# EAGLE schematic MSP-EXP430F5529_2_2 (EAGLE 6.5.0)

## Sheet 1 of 8
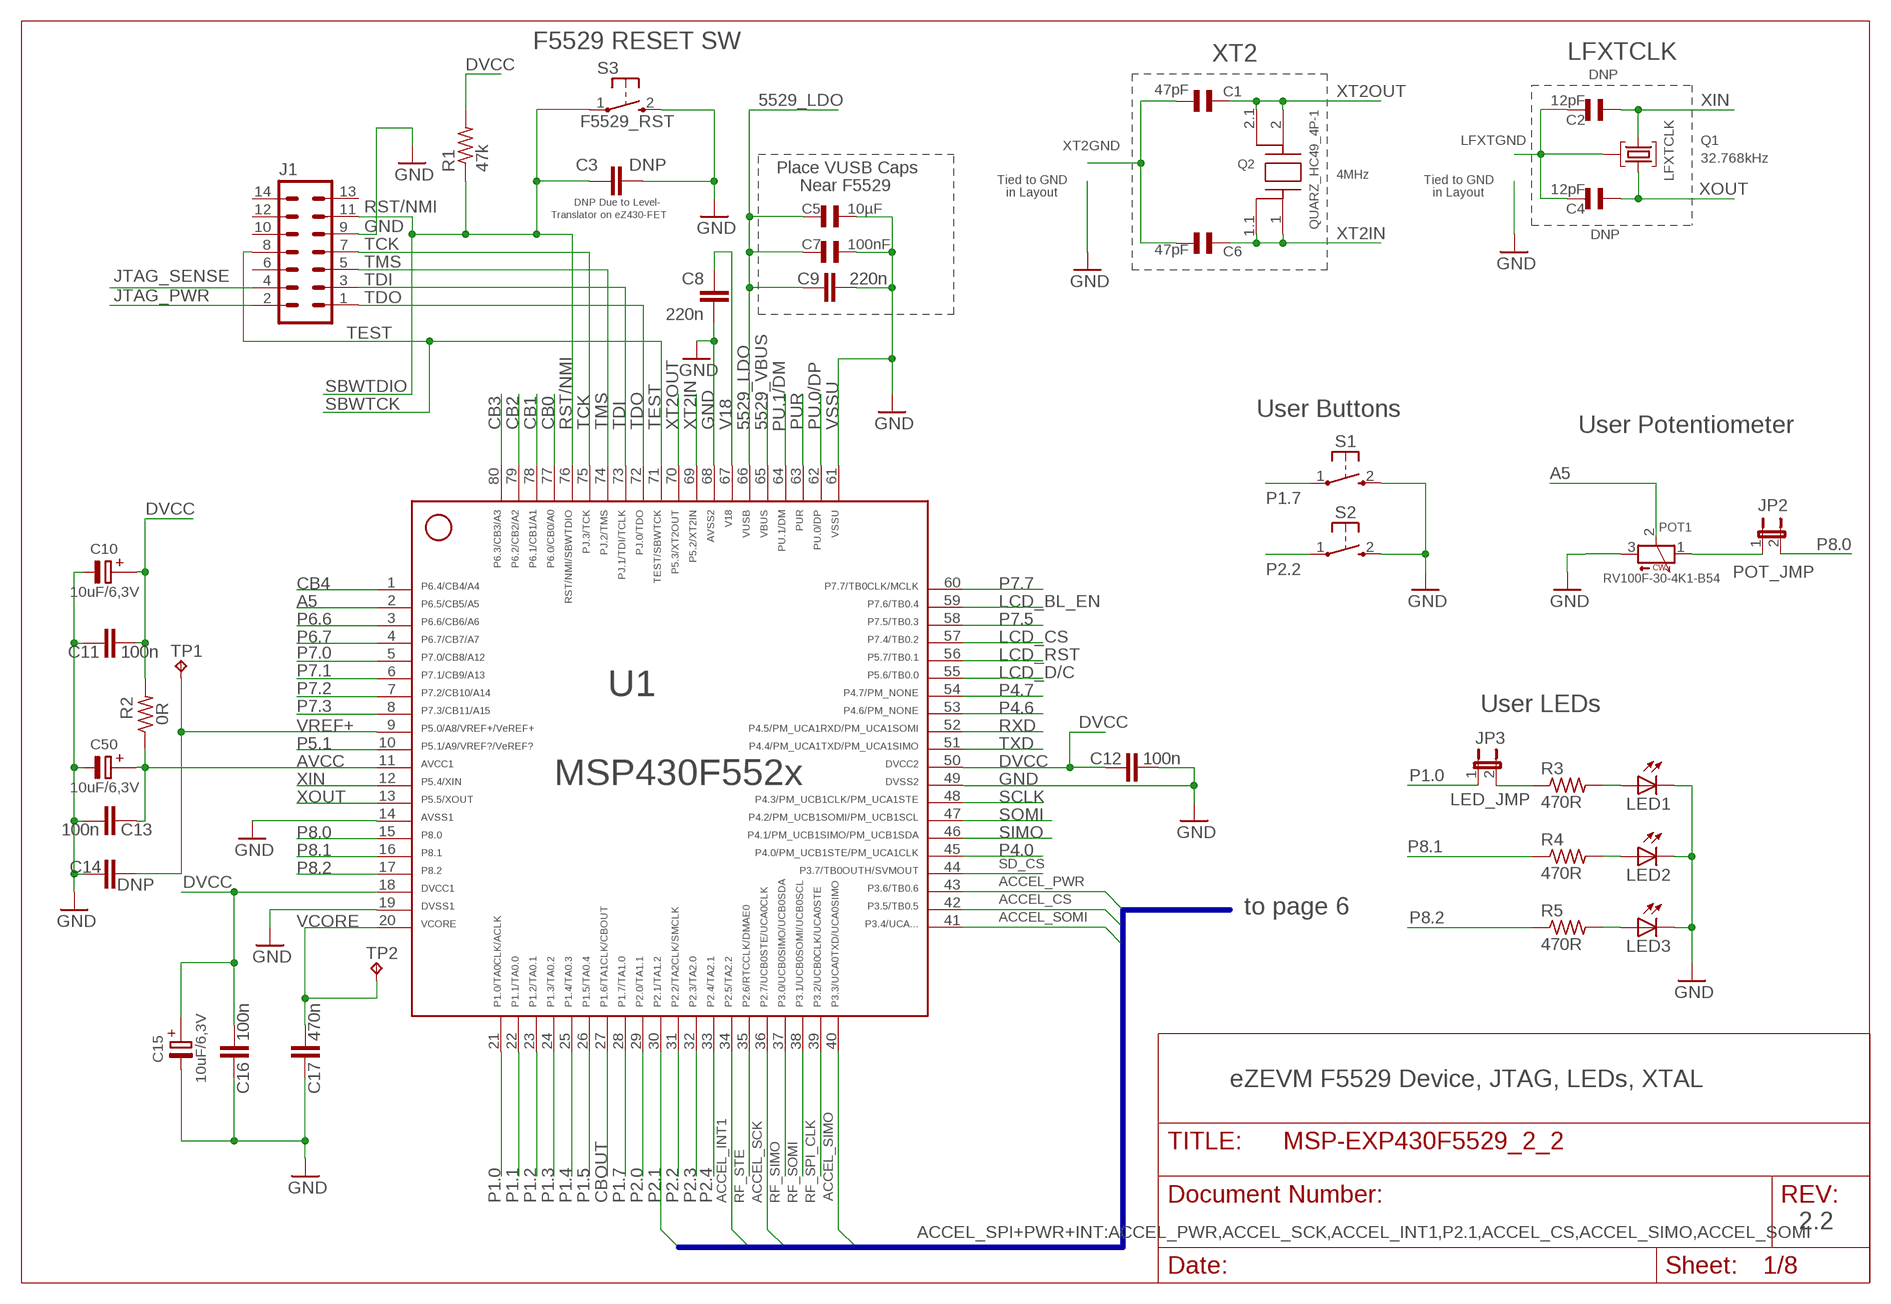
[diagram p0: schematic, sheet 1]

### Parts
C1  47pF  CSMD0805  [CSMD0805]
C2  12pF  CSMD0805  [CSMD0805]
C3  DNP  C-EUC0603  [C0603]
C4  12pF  CSMD0805  [CSMD0805]
C5  10µF  CSMD0805  [CSMD0805]
C6  47pF  CSMD0805  [CSMD0805]
C7  100nF  CSMD0805  [CSMD0805]
C8  220n  C-EUC0603  [C0603]
C9  220n  C-EUC0603  [C0603]
C10  10uF/6,3V  ELKO_1210  [1210ELKO]
C11  100n  C-EUC0603  [C0603]
C12  100n  C-EUC0805  [C0805]
C13  100n  C-EUC0805  [C0805]
C14  DNP  C-EUC0603  [C0603]
C15  10uF/6,3V  ELKO_1210  [1210ELKO]
C16  100n  C-EUC0805  [C0805]
C17  470n  C-EUC0805  [C0805]
C50  10uF/6,3V  ELKO_1210  [1210ELKO]
J1  ML14  [ML14]
JP2  POT_JMP  JP1E\SMALL_PIN  [JP1S]
JP3  LED_JMP  JP1E\SMALL_PIN  [JP1S]
LED1  LEDCHIPLED_0603  [CHIPLED_0603]
LED2  LEDCHIPLED_0603  [CHIPLED_0603]
LED3  LEDCHIPLED_0603  [CHIPLED_0603]
POT1  RV100F-30-4K1-B54  [TW-700171]
Q1  32.768kHz  F20XX_PIR_DEMO_&_EVAL_CM200T  [F20XX_PIR_DEMO_&_EVAL_CMJ206T]
Q2  QUARZ_HC49_4P-1  [QUARZ_HC49_4P]
R1  47k  R-US_R0603  [R0603]
R2  0R  R-US_R0603  [R0603]
R3  470R  R-US_R0603  [R0603]
R4  470R  R-US_R0603  [R0603]
R5  470R  R-US_R0603  [R0603]
S1  PB  [PBTH]
S2  PB  [PBTH]
S3  F5529_RST  PB  [PBTH]
TP1  TP  [TP]
TP2  TP  [TP]
U1  MSP430F5529IPNR  F552X---PN80  [PN80]

### Nets
5529_LDO [Power]: C5.1 C7.1 C9.1 U1.66 ; also sheet 3,4
5529_VBUS [Power]: U1.65 ; also sheet 3,4
A5: POT1.2(TAP) U1.2
ACCEL_CS: U1.42 ; also sheet 7
ACCEL_INT1: U1.34 ; also sheet 7
ACCEL_PWR: U1.43 ; also sheet 7
ACCEL_SCK: U1.36 ; also sheet 7
ACCEL_SIMO: U1.40 ; also sheet 7
ACCEL_SOMI: U1.41 ; also sheet 7
AVCC: C13.1 C50.+ R2.1 U1.11
CB0: U1.77 ; also sheet 2
CB1: U1.78 ; also sheet 2
CB2: U1.79 ; also sheet 2
CB3: U1.80 ; also sheet 2
CB4: U1.1 ; also sheet 2
CBOUT: U1.27 ; also sheet 2
DVCC [Power]: C10.+ C11.2 C12.1 C15.+ C16.2 R1.2 R2.2 U1.18 U1.50 ; also sheet 3,5
GND [Ground]: C3.1 C5.2 C7.2 C8.2 C9.2 C10.- C11.1 C12.2 C13.2 C14.1 C15.- C16.1 C17.1 C50.- J1.9 LED1.C LED2.C LED3.C POT1.3(CW) S1.2(S) S2.2(S) S3.2(S) U1.14 U1.19 U1.49 U1.61 U1.68 ; also sheet 2,3,4,5,6,7
JTAG_PWR [Power]: J1.2 ; also sheet 3
JTAG_SENSE: J1.4 ; also sheet 3
LCD_BL_EN: U1.59 ; also sheet 3
LCD_CS: U1.57 ; also sheet 3
LCD_D/C: U1.55 ; also sheet 3
LCD_RST: U1.56 ; also sheet 3
LFXTGND: C2.2 C4.2 Q1.P3(GND)
N$21: LED3.A R5.2
N$32: LED1.A R3.2
N$35: LED2.A R4.2
N$36: JP3.2 R3.1
N$43: JP2.1 POT1.1(CCW)
P1.0: JP3.1 U1.21 ; also sheet 4
P1.1: U1.22 ; also sheet 2
P1.2: U1.23 ; also sheet 2
P1.3: U1.24 ; also sheet 2
P1.4: U1.25 ; also sheet 2
P1.5: U1.26 ; also sheet 2
P1.7: S1.1(P) U1.28
P2.0: U1.29 ; also sheet 4
P2.1: U1.30 ; also sheet 4,7
P2.2: S2.1(P) U1.31
P2.3: U1.32 ; also sheet 4
P2.4: U1.33 ; also sheet 4
P4.0: U1.45 ; also sheet 2,4
P4.6: U1.53 ; also sheet 2,4
P4.7: U1.54 ; also sheet 2,4
P5.1: U1.10 ; also sheet 2
P6.6: U1.3 ; also sheet 2,4
P6.7: U1.4 ; also sheet 2
P7.0: U1.5 ; also sheet 2
P7.1: U1.6 ; also sheet 2
P7.2: U1.7 ; also sheet 2
P7.3: U1.8 ; also sheet 2
P7.5: U1.58 ; also sheet 4
P7.7: U1.60 ; also sheet 2
P8.0: JP2.2 U1.15 ; also sheet 2
P8.1: R4.1 U1.16 ; also sheet 2
P8.2: R5.1 U1.17 ; also sheet 2
PU.0/DP: U1.62 ; also sheet 4
PU.1/DM: U1.64 ; also sheet 4
PUR: U1.63 ; also sheet 4
RF_SIMO: U1.37 ; also sheet 4
RF_SOMI: U1.38 ; also sheet 4
RF_SPI_CLK: U1.39 ; also sheet 4
RF_STE: U1.35 ; also sheet 4
RST/NMI: C3.2 J1.11 R1.1 S3.1(P) U1.76 ; also sheet 5
RXD: U1.52 ; also sheet 2,4,5
SCLK: U1.48 ; also sheet 2,3
SD_CS: U1.44 ; also sheet 2
SIMO: U1.46 ; also sheet 2,3
SOMI: U1.47 ; also sheet 2
TCK: J1.7 U1.75
TDI: J1.3 U1.73
TDO: J1.1 U1.72
TEST: J1.8 U1.71 ; also sheet 5
TMS: J1.5 U1.74
TXD: U1.51 ; also sheet 2,4,5
V18: C8.1 U1.67
VCORE: C17.2 TP2.1(TP) U1.20
VREF+: C14.2 TP1.1(TP) U1.9
XIN: C2.1 Q1.P2 U1.12
XOUT: C4.1 Q1.P1 U1.13
XT2GND [Ground]: C1.2 C6.2
XT2IN: C6.1 Q2.1 Q2.1.1 U1.69
XT2OUT: C1.1 Q2.2 Q2.2.1 U1.70
Unconnected: J1.6 J1.10 J1.12 J1.13 J1.14

### Buses
ACCEL_SPI+PWR+INT:ACCEL_PWR,ACCEL_SCK,ACCEL_INT1,P2.1,ACCEL_CS,ACCEL_SIMO,ACCEL_SOMI

### Notes on the sheet
- F5529 RESET SW
- XT2 | LFXTCLK
- DNP
- Place VUSB Caps | 4MHz
- Tied to GND | Tied to GND | LFXTCLK
- Near F5529
- in Layout | in Layout
- DNP Due to Level-
- Translator on eZ430-FET
- DNP
- SBWTDIO
- SBWTCK
- User Buttons
- VSSU | User Potentiometer
- User LEDs
- to page 6
- eZEVM F5529 Device, JTAG, LEDs, XTAL
- 2.2

## Sheet 2 of 8
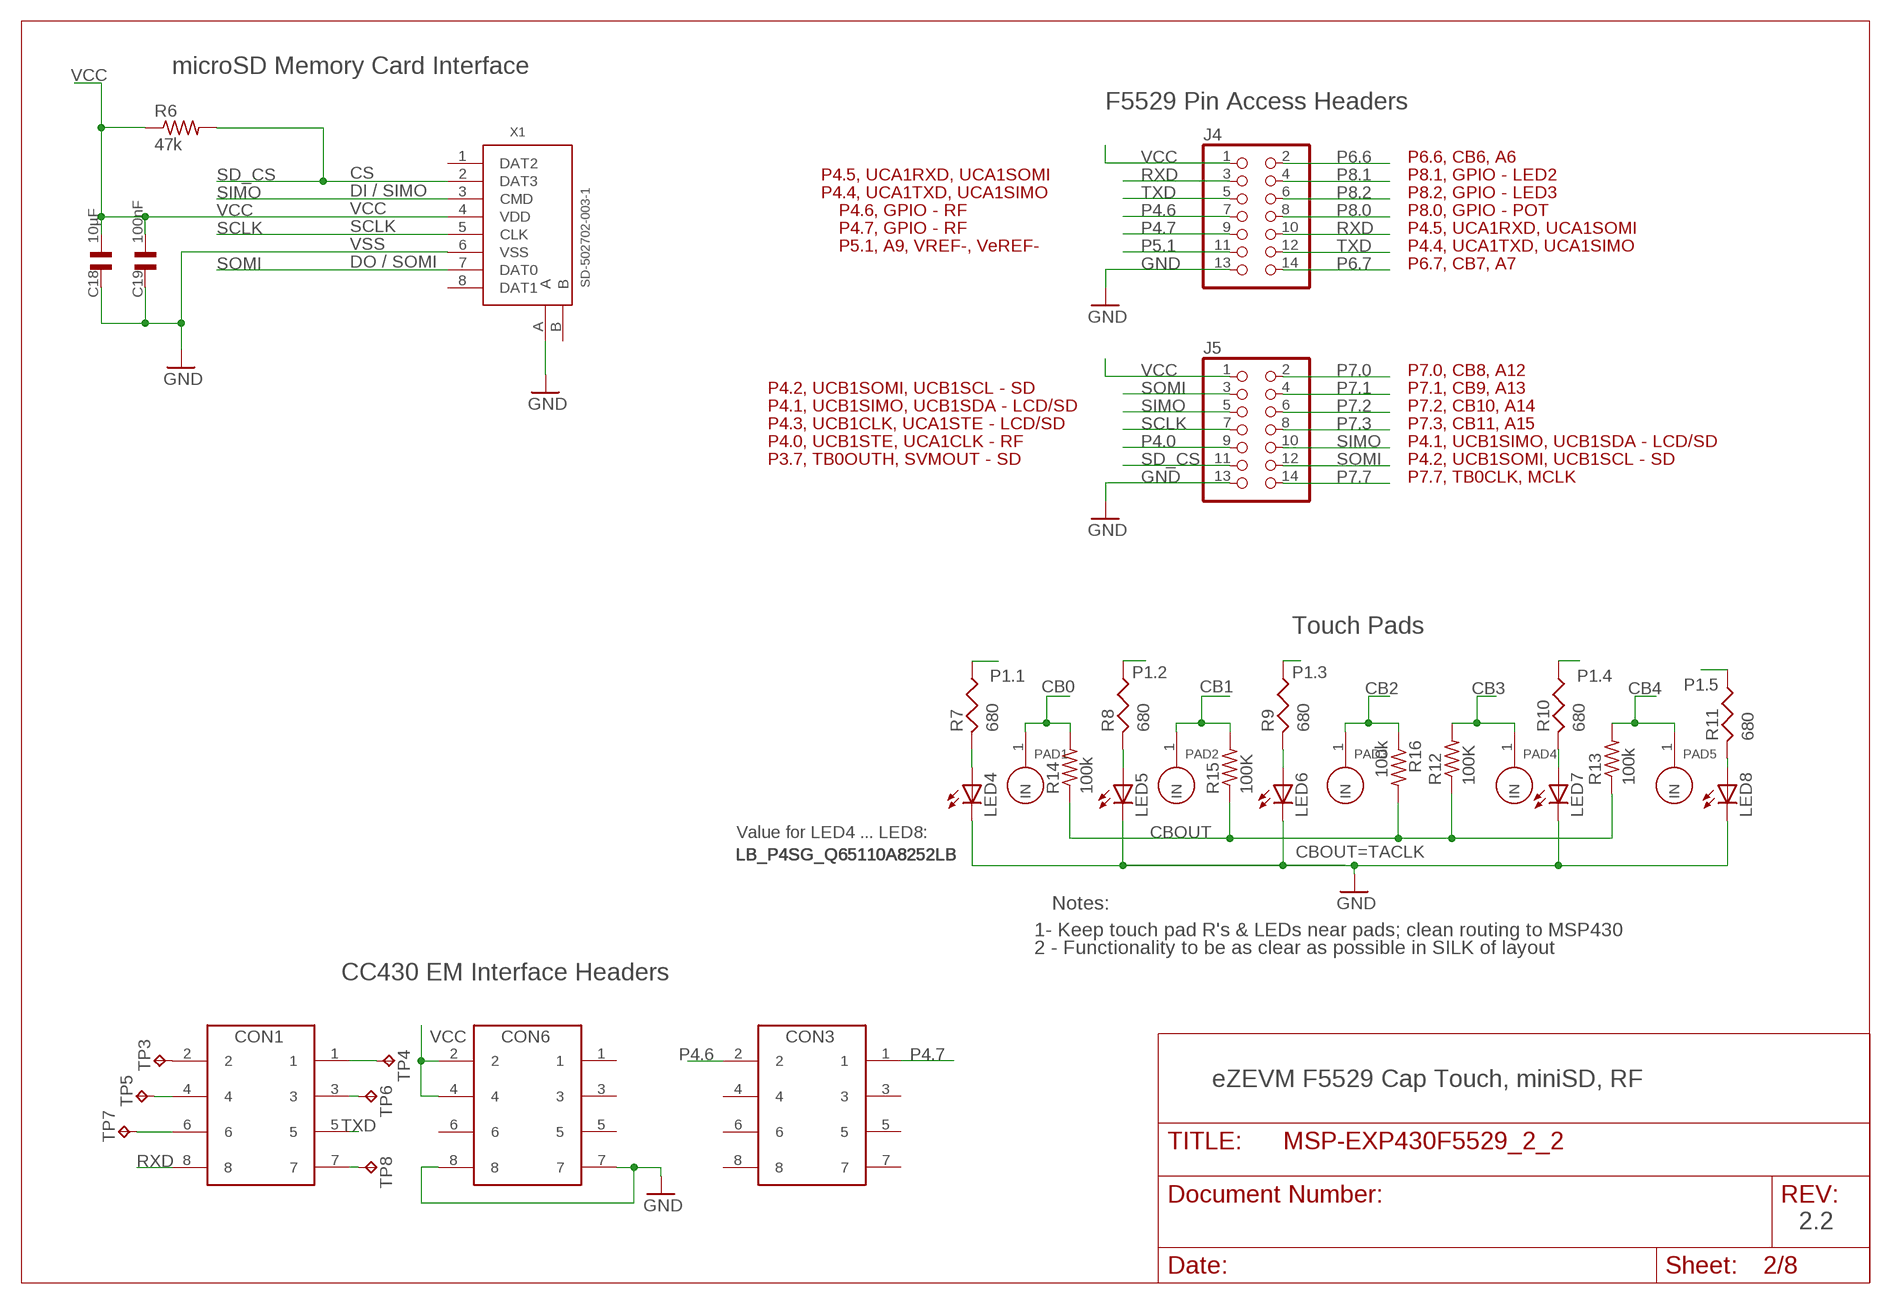
[diagram p1: schematic, sheet 2]

### Parts
C18  10µF  CSMD0805  [CSMD0805]
C19  100nF  CSMD0805  [CSMD0805]
CON1  8PIN_SM_MA_HEADER  [8PIN_SM_MA_HEADER]
CON2  8PIN_SM_MA_HEADER  [8PIN_SM_MA_HEADER]
CON3  8PIN_SM_MA_HEADER  [8PIN_SM_MA_HEADER]
J4  PINHD-2X7  [2X07]
J5  PINHD-2X7  [2X07]
LED4  LB_P4SG_Q65110A8252LB  [LB_P4SG_Q65110A8252]
LED5  LB_P4SG_Q65110A8252LB  [LB_P4SG_Q65110A8252]
LED6  LB_P4SG_Q65110A8252LB  [LB_P4SG_Q65110A8252]
LED7  LB_P4SG_Q65110A8252LB  [LB_P4SG_Q65110A8252]
LED8  LB_P4SG_Q65110A8252LB  [LB_P4SG_Q65110A8252]
PAD1  TPAD_TOPLB_P4SG  [PAD_10X10_LB_P4SG]
PAD2  TPAD_TOPLB_P4SG  [PAD_10X10_LB_P4SG]
PAD3  TPAD_TOPLB_P4SG  [PAD_10X10_LB_P4SG]
PAD4  TPAD_TOPLB_P4SG  [PAD_10X10_LB_P4SG]
PAD5  TPAD_TOPLB_P4SG  [PAD_10X10_LB_P4SG]
R6  47k  R-US_R0603  [R0603]
R7  680  RES0805  [R0805]
R8  680  RES0805  [R0805]
R9  680  RES0805  [R0805]
R10  680  RES0805  [R0805]
R11  680  RES0805  [R0805]
R12  100K  R-US_R0603  [R0603]
R13  100k  R-US_R0603  [R0603]
R14  100k  R-US_R0603  [R0603]
R15  100K  R-US_R0603  [R0603]
R16  100k  R-US_R0603  [R0603]
TP3  TP  [TP]
TP4  TP  [TP]
TP5  TP  [TP]
TP6  TP  [TP]
TP7  TP  [TP]
TP8  TP  [TP]
X1  SD-502702-003-1  [SD-502702-003]

### Nets
CB0: PAD1.1(IN) R14.2 ; also sheet 1
CB1: PAD2.1(IN) R15.2 ; also sheet 1
CB2: PAD3.1(IN) R16.1 ; also sheet 1
CB3: PAD4.1(IN) R12.2 ; also sheet 1
CB4: PAD5.1(IN) R13.2 ; also sheet 1
CBOUT: R12.1 R13.1 R14.1 R15.1 R16.2 ; also sheet 1
GND [Ground]: C18.1 C19.1 CON2.7 CON2.8 J4.13 J5.13 LED4.C LED5.C LED6.C LED7.C LED8.C X1.6(VSS) X1.A ; also sheet 1,3,4,5,6,7
N$7: LED7.A R10.2
N$8: LED5.A R8.2
N$10: LED6.A R9.2
N$11: LED4.A R7.2
N$12: CON1.6 TP7.1(TP)
N$13: LED8.A R11.2
N$20: CON1.4 TP5.1(TP)
N$27: CON1.2 TP3.1(TP)
N$28: CON1.1 TP4.1(TP)
N$29: CON1.3 TP6.1(TP)
N$38: CON1.7 TP8.1(TP)
P1.1: R7.1 ; also sheet 1
P1.2: R8.1 ; also sheet 1
P1.3: R9.1 ; also sheet 1
P1.4: R10.1 ; also sheet 1
P1.5: R11.1 ; also sheet 1
P4.0: J5.9 ; also sheet 1,4
P4.6: CON3.2 J4.7 ; also sheet 1,4
P4.7: CON3.1 J4.9 ; also sheet 1,4
P5.1: J4.11 ; also sheet 1
P6.6: J4.2 ; also sheet 1,4
P6.7: J4.14 ; also sheet 1
P7.0: J5.2 ; also sheet 1
P7.1: J5.4 ; also sheet 1
P7.2: J5.6 ; also sheet 1
P7.3: J5.8 ; also sheet 1
P7.7: J5.14 ; also sheet 1
P8.0: J4.8 ; also sheet 1
P8.1: J4.4 ; also sheet 1
P8.2: J4.6 ; also sheet 1
RXD: CON1.8 J4.3 J4.10 ; also sheet 1,4,5
SCLK: J5.7 X1.5(CLK) ; also sheet 1,3
SD_CS: J5.11 R6.2 X1.2(DAT3) ; also sheet 1
SIMO: J5.5 J5.10 X1.3(CMD) ; also sheet 1,3
SOMI: J5.3 J5.12 X1.7(DAT0) ; also sheet 1
TXD: CON1.5 J4.5 J4.12 ; also sheet 1,4,5
VCC [Power]: C18.2 C19.2 CON2.2 CON2.4 J4.1 J5.1 R6.1 X1.4(VDD) ; also sheet 3,4
Unconnected: CON2.1 CON2.3 CON2.5 CON2.6 CON3.3 CON3.4 CON3.5 CON3.6 CON3.7 CON3.8 X1.1(DAT2) X1.8(DAT1) X1.B

### Notes on the sheet
- microSD Memory Card Interface
- F5529 Pin Access Headers
- P6.6, CB6, A6
- CS | P4.5, UCA1RXD, UCA1SOMI | P8.1, GPIO - LED2
- DI / SIMO | P4.4, UCA1TXD, UCA1SIMO | P8.2, GPIO - LED3
- VCC | P4.6, GPIO - RF | P8.0, GPIO - POT
- SCLK | P4.7, GPIO - RF | P4.5, UCA1RXD, UCA1SOMI
- VSS | P5.1, A9, VREF-, VeREF- | P4.4, UCA1TXD, UCA1SIMO
- DO / SOMI | P6.7, CB7, A7
- P7.0, CB8, A12
- P4.2, UCB1SOMI, UCB1SCL - SD | P7.1, CB9, A13
- P4.1, UCB1SIMO, UCB1SDA - LCD/SD | P7.2, CB10, A14
- P4.3, UCB1CLK, UCA1STE - LCD/SD | P7.3, CB11, A15
- P4.0, UCB1STE, UCA1CLK - RF | P4.1, UCB1SIMO, UCB1SDA - LCD/SD
- P3.7, TB0OUTH, SVMOUT - SD | P4.2, UCB1SOMI, UCB1SCL - SD
- P7.7, TB0CLK, MCLK
- Touch Pads
- Value for LED4 ... LED8:
- CBOUT=TACLK
- Notes:
- 1- Keep touch pad R's & LEDs near pads; clean routing to MSP430
- 2 - Functionality to be as clear as possible in SILK of layout
- CC430 EM Interface Headers
- CON1 | CON6 | CON3
- eZEVM F5529 Cap Touch, miniSD, RF
- 2.2

## Sheet 3 of 8
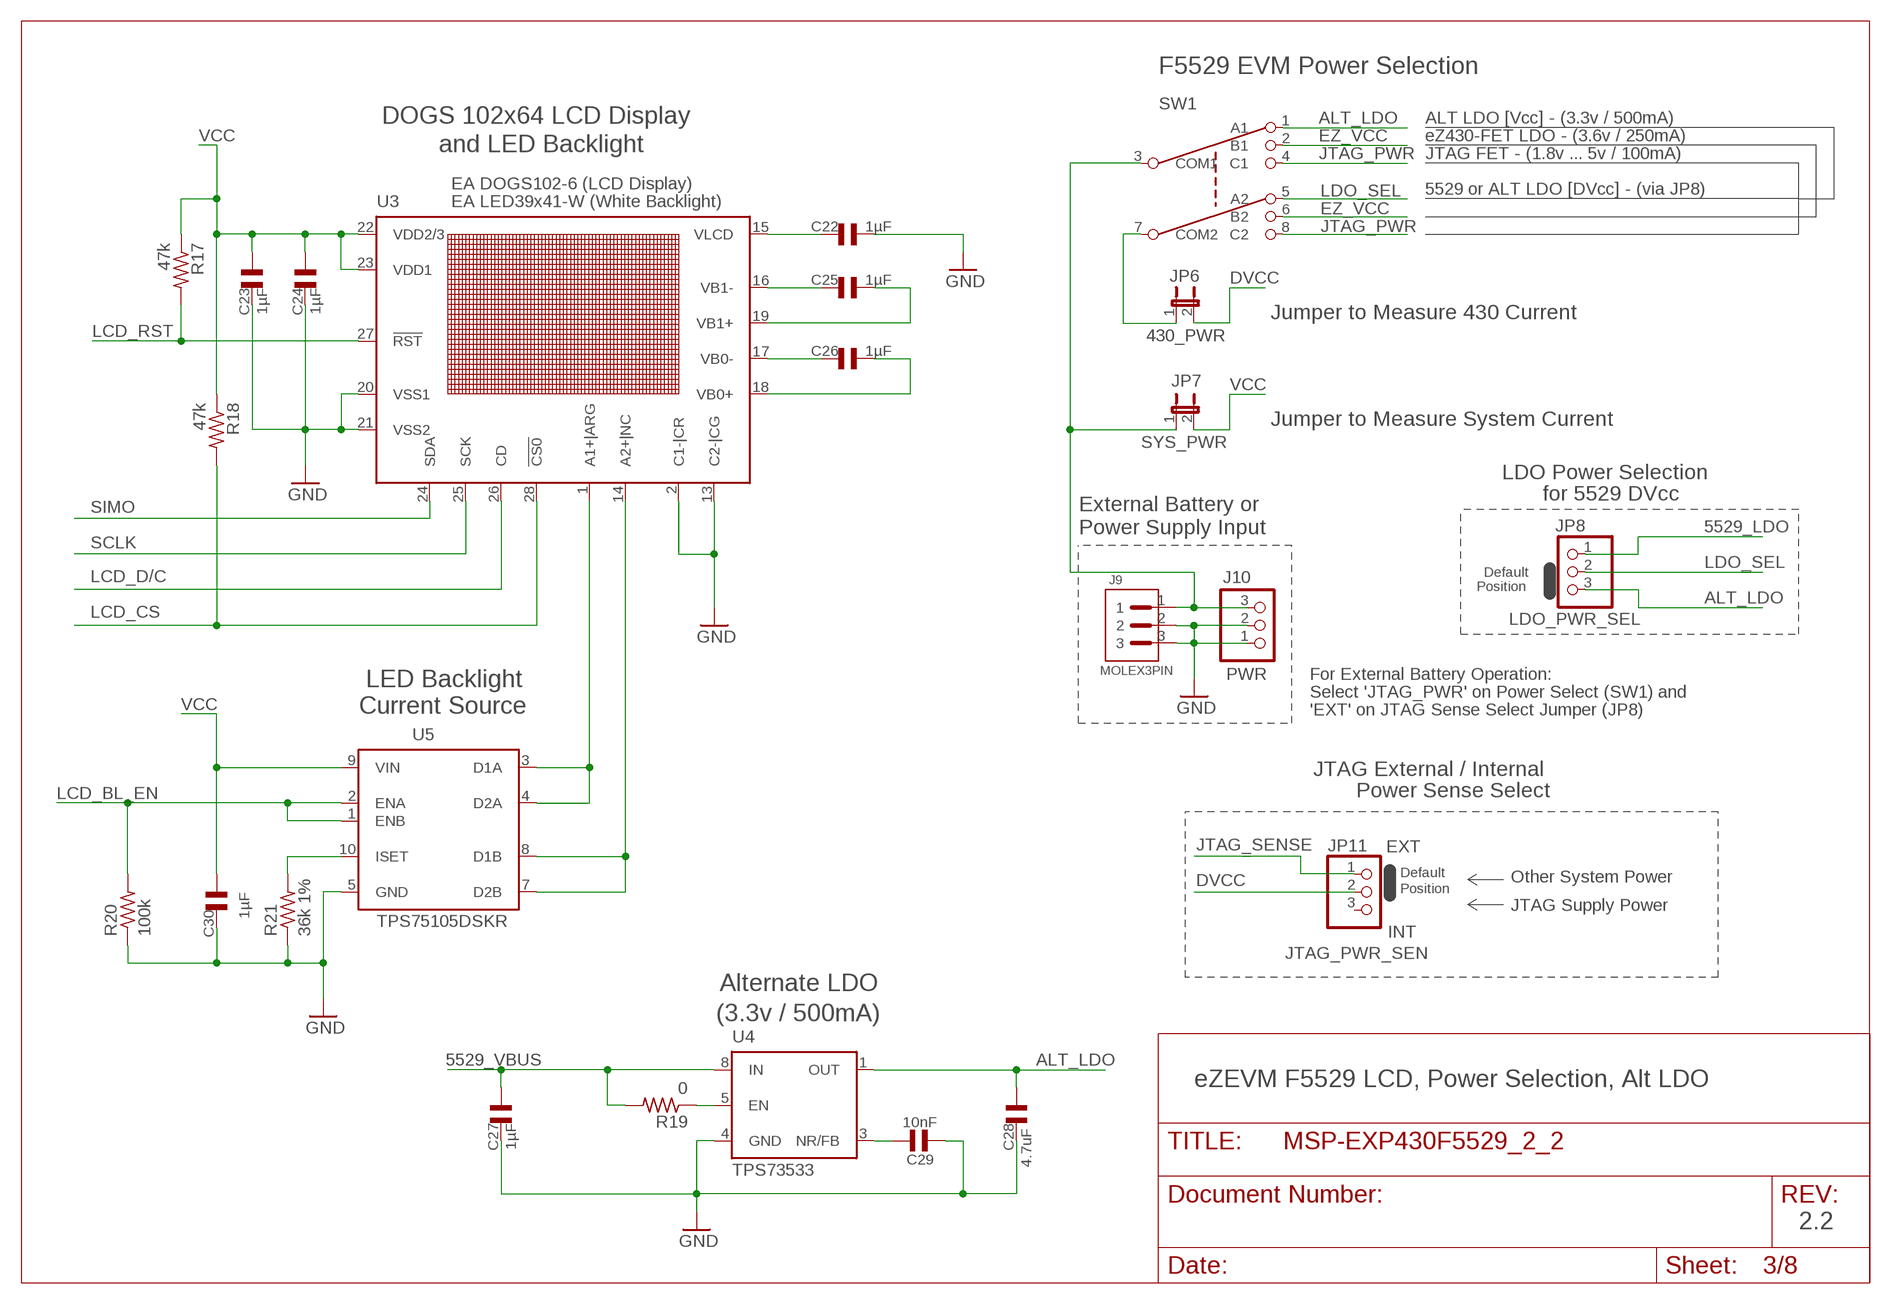
[diagram p2: schematic, sheet 3]

### Parts
C22  1µF  CSMD0805  [CSMD0805]
C23  1µF  CSMD0805  [CSMD0805]
C24  1µF  CSMD0805  [CSMD0805]
C25  1µF  CSMD0805  [CSMD0805]
C26  1µF  CSMD0805  [CSMD0805]
C27  1µF  CSMD0805  [CSMD0805]
C28  4.7uF  CSMD0805  [CSMD0805]
C29  10nF  CSMD0805  [CSMD0805]
C30  1µF  CSMD0805  [CSMD0805]
J9  MOLEX3PIN  [MOLEX-3P-HEADER]
J10  PWR  PINHD-1X3  [1X03]
JP6  430_PWR  JP1E  [JP1]
JP7  SYS_PWR  JP1E  [JP1]
JP8  LDO_PWR_SEL  PINHD-1X3/SMALL_PIN  [1X03S]
JP11  JTAG_PWR_SEN  PINHD-1X3/SMALL_PIN  [1X03S]
R17  47k  R-US_R0603  [R0603]
R18  47k  R-US_R0603  [R0603]
R19  0  R-US_R0603  [R0603]
R20  100k  R-US_R0603  [R0603]
R21  36k 1%  R-US_R0603  [R0603]
SW1  3PDT  [3PDT]
U3  EA DOGS102-6 (LCD Display)  EADOGS102-6  [EADOGS102-6]
U4  TPS73533  TPS735  [DRB_S-PVSON-N8]
U5  TPS75105DSKR  TPS7510X  [DSK_S-PDSO-N10]

### Nets
5529_LDO [Power]: JP8.1 ; also sheet 1,4
5529_VBUS [Power]: C27.2 R19.2 U4.8(IN) ; also sheet 1,4
ALT_LDO [Power]: C28.2 JP8.3 SW1.1(A1) U4.1(OUT)
D1A: U3.1(A1+|ARG) U5.3(D1A) U5.4(D2A)
D1B: U3.14(A2+|NC) U5.7(D2B) U5.8(D1B)
DVCC [Power]: JP6.2 JP11.2 ; also sheet 1,5
DVCC_SW [Power]: JP6.1 SW1.7(COM2)
EZ_VCC [Power]: SW1.2(B1) SW1.6(B2) ; also sheet 5,6
GND [Ground]: C22.2 C23.1 C24.1 C27.1 C28.1 C29.1 C30.1 J9.2 J9.3 J10.1 J10.2 R20.1 R21.1 U3.2(C1-|CR) U3.13(C2-|CG) U3.20(VSS1) U3.21(VSS2) U4.4(GND) U5.5(GND) ; also sheet 1,2,4,5,6,7
ISET: R21.2 U5.10(ISET)
JTAG_PWR [Power]: SW1.4(C1) SW1.8(C2) ; also sheet 1
JTAG_SENSE: JP11.1 ; also sheet 1
LCD_BL_EN: R20.2 U5.1(ENB) U5.2(ENA) ; also sheet 1
LCD_CS: R18.2 U3.28(!CS0) ; also sheet 1
LCD_D/C: U3.26(CD) ; also sheet 1
LCD_RST: R17.2 U3.27(!RST) ; also sheet 1
LDO_SEL [Power]: JP8.2 SW1.5(A2)
N$14: R19.1 U4.5(EN)
N$41: C25.1 U3.16(VB1-)
N$44: C25.2 U3.19(VB1+)
N$45: C26.1 U3.17(VB0-)
N$46: C26.2 U3.18(VB0+)
N$50: C29.2 U4.3(NR/FB)
SCLK: U3.25(SCK) ; also sheet 1,2
SIMO: U3.24(SDA) ; also sheet 1,2
VCC [Power]: C23.2 C24.2 C30.2 JP7.2 R17.1 R18.1 U3.22(VDD2/3) U3.23(VDD1) U5.9(VIN) ; also sheet 2,4
VCC_SW [Power]: J9.1 J10.3 JP7.1 SW1.3(COM1)
VLCD: C22.1 U3.15(VLCD)
Unconnected: JP11.3

### Notes on the sheet
- F5529 EVM Power Selection
- DOGS 102x64 LCD Display | ALT LDO [Vcc] - (3.3v / 500mA)
- eZ430-FET LDO - (3.6v / 250mA)
- and LED Backlight
- JTAG FET - (1.8v ... 5v / 100mA)
- 5529 or ALT LDO [DVcc] - (via JP8)
- EA LED39x41-W (White Backlight)
- Jumper to Measure 430 Current
- Jumper to Measure System Current
- LDO Power Selection
- for 5529 DVcc
- External Battery or
- Power Supply Input
- Default
- Position
- For External Battery Operation:
- LED Backlight
- Select 'JTAG_PWR' on Power Select (SW1) and
- Current Source | 'EXT' on JTAG Sense Select Jumper (JP8)
- JTAG External / Internal
- Power Sense Select
- EXT
- Default
- Other System Power
- Position
- JTAG Supply Power
- INT
- Alternate LDO
- (3.3v / 500mA)
- eZEVM F5529 LCD, Power Selection, Alt LDO
- 2.2

## Sheet 4 of 8
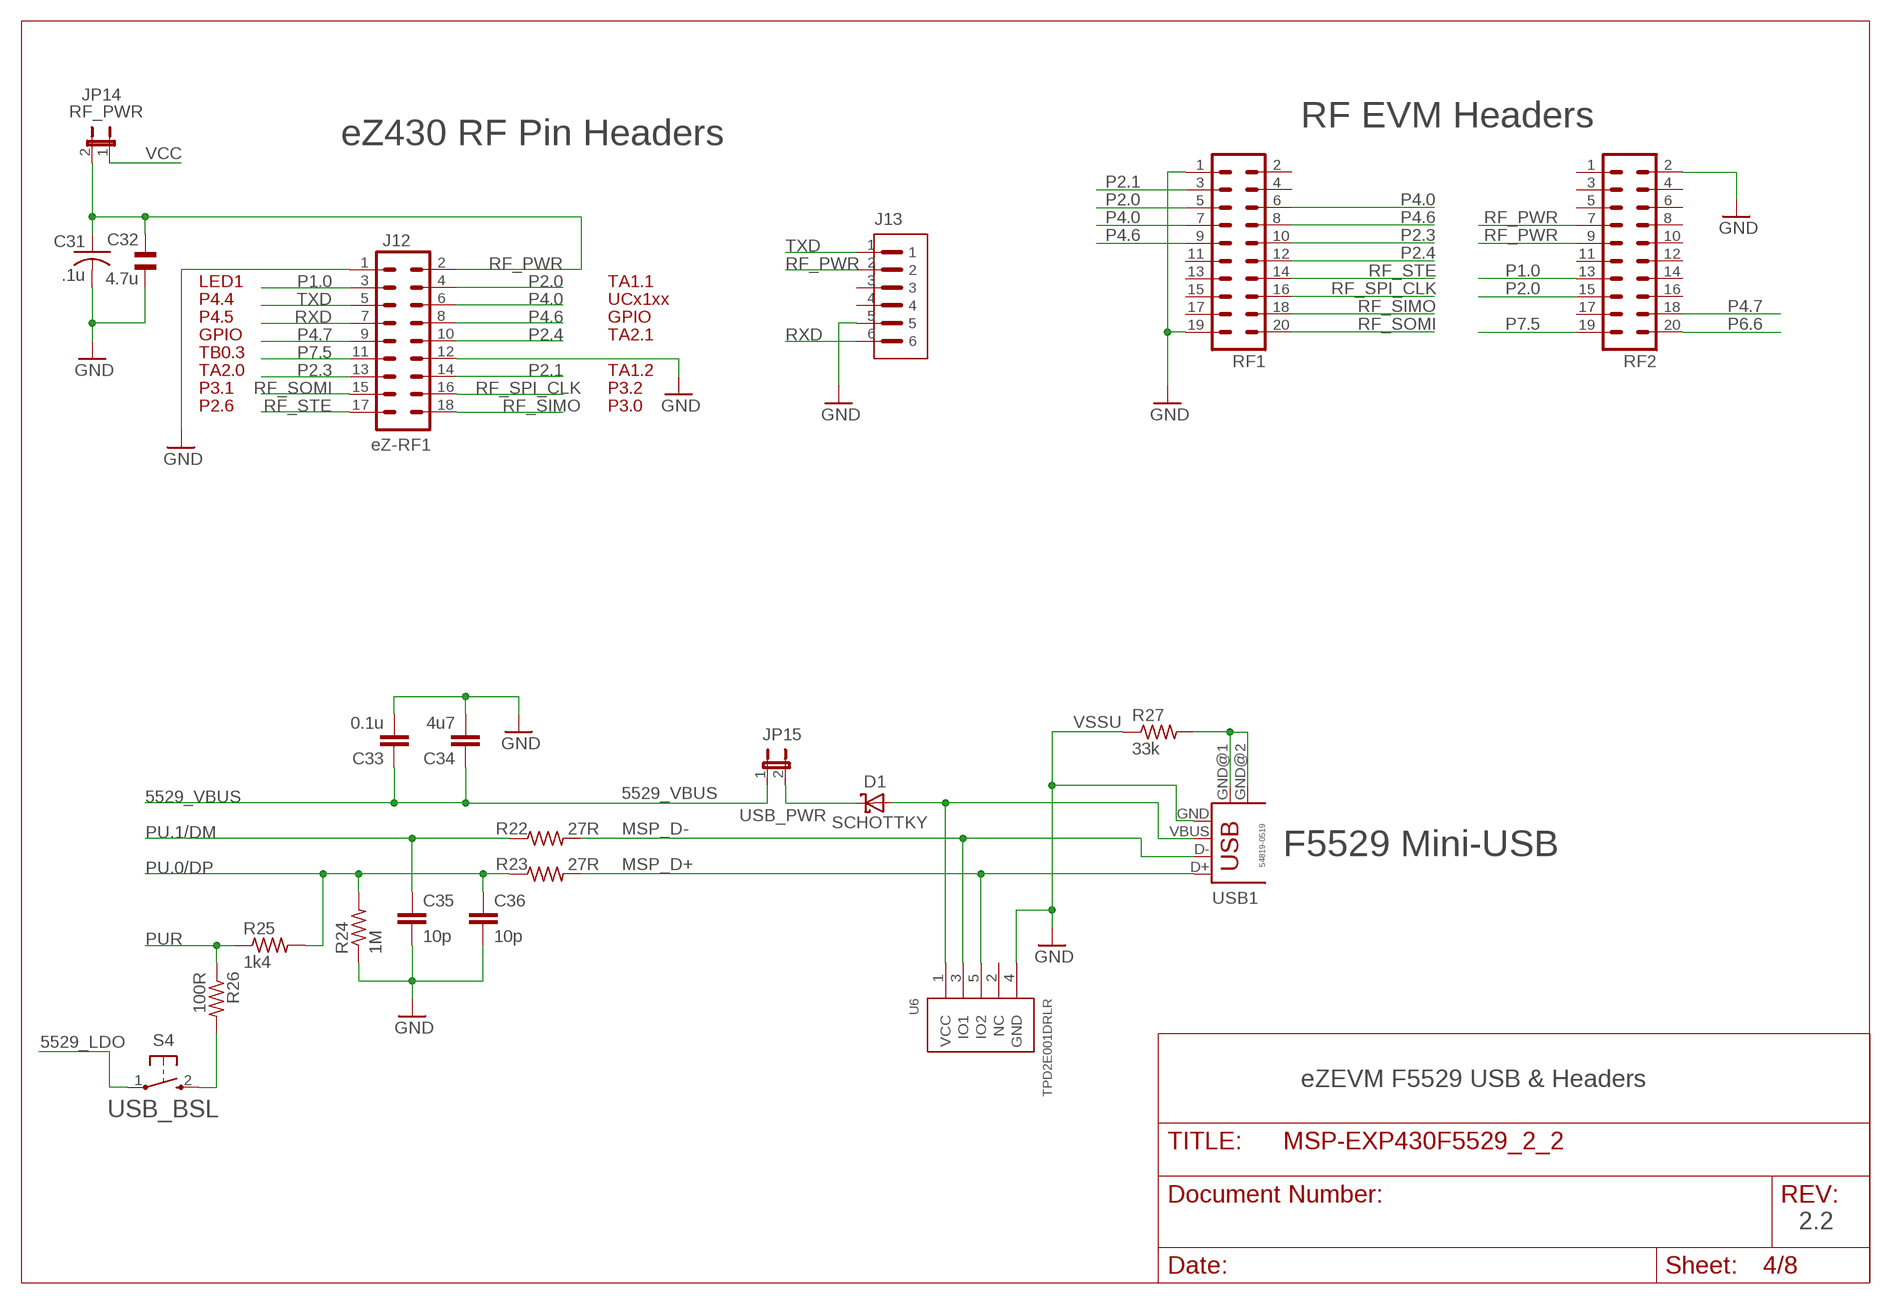
[diagram p3: schematic, sheet 4]

### Parts
C31  .1u  C-USC0603  [C0603]
C32  4.7u  CSMD0805  [CSMD0805]
C33  0.1u  C-EUC0603  [C0603]
C34  4u7  C-EUC0603  [C0603]
C35  10p  C-EUC0603  [C0603]
C36  10p  C-EUC0603  [C0603]
D1  SCHOTTKY  SCHOTTKY-MINI-MELF  [MINIMELF]
J12  eZ-RF1  _MSP430_RF_MA09-2  [_MSP430_RF_MA09-2]
J13  eZRF  SL127P6  [SL127L6]
JP14  RF_PWR  JP1E  [JP1]
JP15  USB_PWR  JP1E  [JP1]
R22  27R  R-US_R0603  [R0603]
R23  27R  R-US_R0603  [R0603]
R24  1M  R-US_R0603  [R0603]
R25  1k4  R-US_R0603  [R0603]
R26  100R  R-US_R0603  [R0603]
R27  33k  R-US_R0603  [R0603]
RF1  TFM-110-02-SM-D-A-K  [TFM-110-02-SM-D-A-K]
RF2  TFM-110-02-SM-D-A-K  [TFM-110-02-SM-D-A-K]
S4  USB_BSL  PB  [PBTH]
U6  TPD2E001DRLR  TPD2E001  [TPD2E001-DRL]
USB1  F5529 Mini-USB  USB-MB-H  [USB-MB-H]

### Nets
5529_LDO [Power]: S4.1(P) ; also sheet 1,3
5529_VBUS [Power]: C33.1 C34.1 JP15.1 ; also sheet 1,3
GND [Ground]: C31.2 C32.2 C33.2 C34.2 C35.2 C36.2 J12.1 J12.12 J13.5 R24.1 R27.1 RF1.1 RF1.19 RF2.2 U6.4(GND) USB1.GND ; also sheet 1,2,3,5,6,7
MSP_D+: R23.2 U6.5(IO2) USB1.D+
MSP_D-: R22.2 U6.3(IO1) USB1.D-
N$24: D1.C JP15.2
N$39: R27.2 USB1.GND@1(GND) USB1.GND@2(GND)
N$40: R26.2 S4.2(S)
N$42: D1.A U6.1(VCC) USB1.VBUS
P1.0: J12.3 RF2.13 ; also sheet 1
P2.0: J12.4 RF1.5 RF2.15 ; also sheet 1
P2.1: J12.14 RF1.3 ; also sheet 1,7
P2.3: J12.13 RF1.10 ; also sheet 1
P2.4: J12.10 RF1.12 ; also sheet 1
P4.0: J12.6 RF1.6 RF1.7 ; also sheet 1,2
P4.6: J12.8 RF1.8 RF1.9 ; also sheet 1,2
P4.7: J12.9 RF2.18 ; also sheet 1,2
P6.6: RF2.20 ; also sheet 1,2
P7.5: J12.11 RF2.19 ; also sheet 1
PU.0/DP: C36.1 R23.1 R24.2 R25.2 ; also sheet 1
PU.1/DM: C35.1 R22.1 ; also sheet 1
PUR: R25.1 R26.1 ; also sheet 1
RF_PWR: C31.1 C32.1 J12.2 J13.2 JP14.2 RF2.7 RF2.9
RF_SIMO: J12.18 RF1.18 ; also sheet 1
RF_SOMI: J12.15 RF1.20 ; also sheet 1
RF_SPI_CLK: J12.16 RF1.16 ; also sheet 1
RF_STE: J12.17 RF1.14 ; also sheet 1
RXD: J12.7 J13.6 ; also sheet 1,2,5
TXD: J12.5 J13.1 ; also sheet 1,2,5
VCC [Power]: JP14.1 ; also sheet 2,3
Unconnected: J13.3 J13.4 RF1.2 RF1.4 RF1.11 RF1.13 RF1.15 RF1.17 RF2.1 RF2.3 RF2.4 RF2.5 RF2.6 RF2.8 RF2.10 RF2.11 RF2.12 RF2.14 RF2.16 RF2.17 U6.2(NC)

### Notes on the sheet
- RF EVM Headers
- eZ430 RF Pin Headers
- LED1 | TA1.1
- P4.4 | UCx1xx
- P4.5 | GPIO
- GPIO | TA2.1
- TB0.3
- TA2.0 | TA1.2
- P3.1 | P3.2
- P2.6 | P3.0
- VSSU
- 54819-0519
- eZEVM F5529 USB & Headers
- 2.2

## Sheet 5 of 8
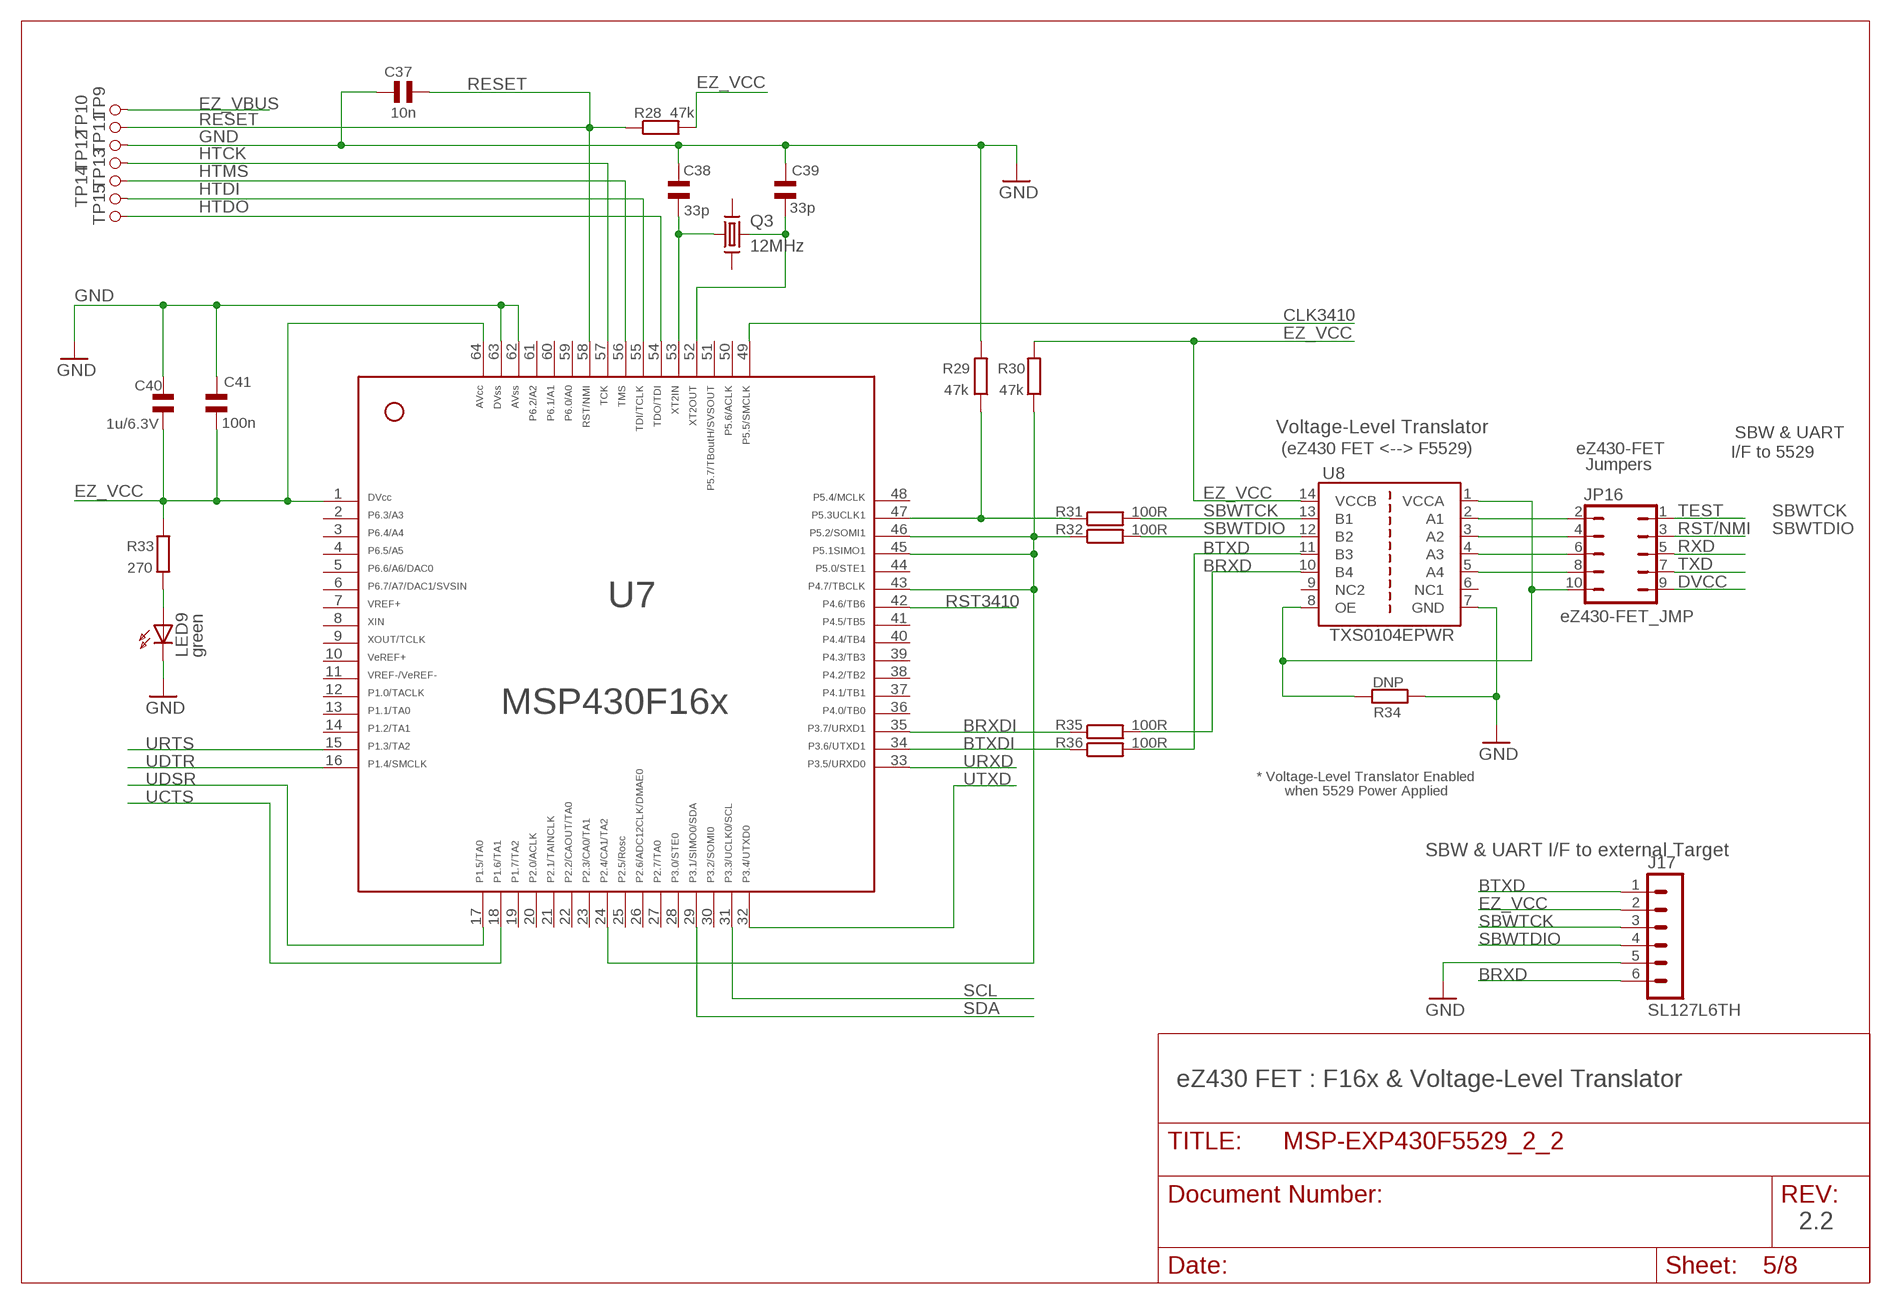
[diagram p4: schematic, sheet 5]

### Parts
C37  10n  C_SMD0402  [0402]
C38  33p  C_SMD0402  [0402]
C39  33p  C_SMD0402  [0402]
C40  1u/6.3V  C_SMD0603  [0603]
C41  100n  C_SMD0402  [0402]
J17  SL127L6TH  [SL127L6_MPE]
JP16  eZ430-FET_JMP  JP5Q  [JP5Q]
LED9  green  LED_0603D0603  [DIODE0603]
Q3  12MHz  XTL_FT7AFT10A  [FT10A]
R28  47k  R_SMDR0402  [0402]
R29  47k  R_SMDR0402  [0402]
R30  47k  R_SMDR0402  [0402]
R31  100R  R_SMDR0402  [0402]
R32  100R  R_SMDR0402  [0402]
R33  270  R_SMDR0402  [0402]
R34  DNP  R_SMDR0402  [0402]
R35  100R  R_SMDR0402  [0402]
R36  100R  R_SMDR0402  [0402]
TP9  TP05TP10  [TP10]
TP10  TP05TP10  [TP10]
TP11  TP05TP10  [TP10]
TP12  TP05TP10  [TP10]
TP13  TP05TP10  [TP10]
TP14  TP05TP10  [TP10]
TP15  TP05TP10  [TP10]
U7  MSP430F1612IPMR  F16X---PM64  [PM/PAG64]
U8  TXS0104EPWR  TXS0104E  [PW_R-PDSO-G14]

### Nets
BRXD: J17.6 R35.2 U8.10(B4)
BRXDI: R35.1 U7.35 ; also sheet 6
BTXD: J17.1 R36.2 U8.11(B3)
BTXDI: R36.1 U7.34 ; also sheet 6
CLK3410: U7.49 ; also sheet 6
DVCC [Power]: JP16.9 ; also sheet 1,3
EZ_VBUS [Power]: TP9.1 ; also sheet 6
EZ_VCC [Power]: C40.2 C41.1 J17.2 R28.2 R30.2 R33.2 U7.1 U7.64 U8.14(VCCB) ; also sheet 3,6
GND [Ground]: C37.2 C38.2 C39.2 C40.1 C41.2 J17.5 LED9.K(C) R29.2 R34.1 TP11.1 U7.62 U7.63 U8.7(GND) ; also sheet 1,2,3,4,6,7
HTCK: TP12.1 U7.57
HTDI: TP14.1 U7.55
HTDO: TP15.1 U7.54
HTMS: TP13.1 U7.56
N$1: R29.1 R31.1 U7.47
N$2: R30.1 R32.1 U7.24 U7.43 U7.45 U7.46
N$15: JP16.2 U8.2(A1)
N$19: LED9.A R33.1
N$23: JP16.4 U8.3(A2)
N$25: JP16.6 U8.4(A3)
N$33: JP16.8 U8.5(A4)
N$34: JP16.10 R34.2 U8.1(VCCA) U8.8(OE)
RESET: C37.1 R28.1 TP10.1 U7.58 ; also sheet 6
RST3410: U7.42 ; also sheet 6
RST/NMI: JP16.3 ; also sheet 1
RXD: JP16.5 ; also sheet 1,2,4
SBWTCK: J17.3 R31.2 U8.13(B1)
SBWTDIO: J17.4 R32.2 U8.12(B2)
SCL: U7.31 ; also sheet 6
SDA: U7.29 ; also sheet 6
TEST: JP16.1 ; also sheet 1
TXD: JP16.7 ; also sheet 1,2,4
UCTS: U7.18 ; also sheet 6
UDSR: U7.17 ; also sheet 6
UDTR: U7.16 ; also sheet 6
URTS: U7.15 ; also sheet 6
URXD: U7.33 ; also sheet 6
UTXD: U7.32 ; also sheet 6
XIN1: C39.1 Q3.P$3 U7.52
XOUT1: C38.1 Q3.P$1 U7.53
Unconnected: Q3.P$2(G2) Q3.P$4(G4) U7.2 U7.3 U7.4 U7.5 U7.6 U7.7 U7.8 U7.9 U7.10 U7.11 U7.12 U7.13 U7.14 U7.19 U7.20 U7.21 U7.22 U7.23 U7.25 U7.26 U7.27 U7.28 U7.30 U7.36 U7.37 U7.38 U7.39 U7.40 U7.41 U7.44 U7.48 U7.50 U7.51 U7.59 U7.60 U7.61 U8.6(NC1) U8.9(NC2)

### Notes on the sheet
- Voltage-Level Translator
- SBW & UART
- (eZ430 FET <--> F5529) | eZ430-FET | I/F to 5529
- Jumpers
- SBWTCK
- SBWTDIO
- * Voltage-Level Translator Enabled
- when 5529 Power Applied
- SBW & UART I/F to external Target
- eZ430 FET : F16x & Voltage-Level Translator
- 2.2

## Sheet 6 of 8
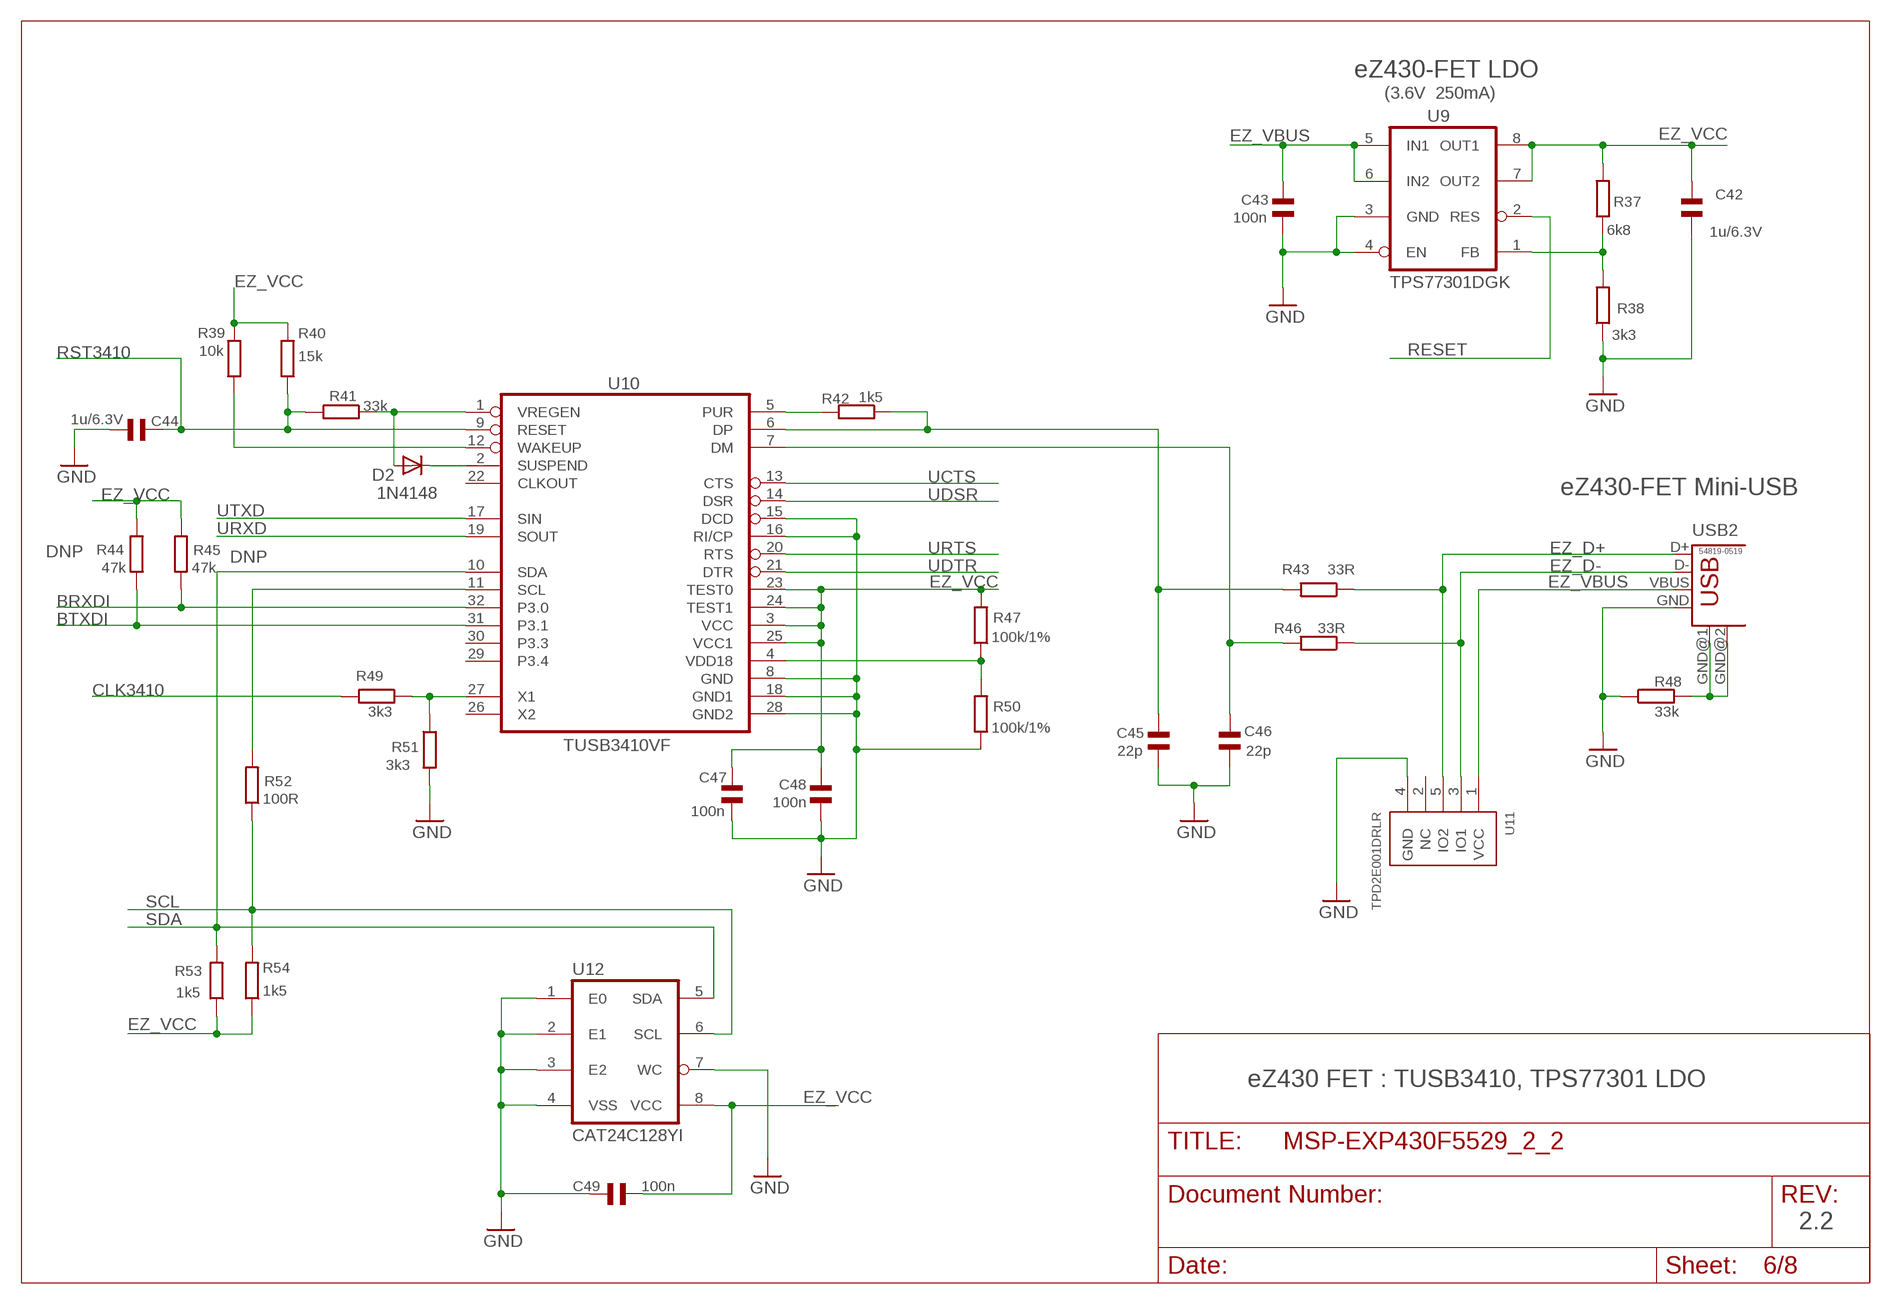
[diagram p5: schematic, sheet 6]

### Parts
C42  1u/6.3V  C_SMD0603  [0603]
C43  100n  C_SMD0402  [0402]
C44  1u/6.3V  C_SMD0603  [0603]
C45  22p  C_SMD0402  [0402]
C46  22p  C_SMD0402  [0402]
C47  100n  C_SMD0402  [0402]
C48  100n  C_SMD0402  [0402]
C49  100n  C_SMD0402  [0402]
D2  1N4148  DIODE-SOD110-R  [SOD110-R]
R37  6k8  R_SMDR0402  [0402]
R38  3k3  R_SMDR0402  [0402]
R39  10k  R_SMDR0402  [0402]
R40  15k  R_SMDR0402  [0402]
R41  33k  R_SMDR0402  [0402]
R42  1k5  R_SMDR0402  [0402]
R43  33R  R_SMDR0402  [0402]
R44  47k  R_SMDR0402  [0402]
R45  47k  R_SMDR0402  [0402]
R46  33R  R_SMDR0402  [0402]
R47  100k/1%  R_SMDR0402  [0402]
R48  33k  R_SMDR0402  [0402]
R49  3k3  R_SMDR0402  [0402]
R50  100k/1%  R_SMDR0402  [0402]
R51  3k3  R_SMDR0402  [0402]
R52  100R  R_SMDR0402  [0402]
R53  1k5  R_SMDR0402  [0402]
R54  1k5  R_SMDR0402  [0402]
U9  TPS77301DGK  TPS773XX  [MSOP8]
U10  TUSB3410VF  TUSB3410  [QFP32]
U11  TPD2E001DRLR  TPD2E001  [TPD2E001-DRL]
U12  CAT24C128YI  USBFET_M24XXX  [USBFET_TSSOP8]
USB2  eZ430-FET Mini-USB  USB-MB-H  [USB-MB-H]

### Nets
BRXDI: R45.1 U10.32(P3.0) ; also sheet 5
BTXDI: R44.1 U10.31(P3.1) ; also sheet 5
CLK3410: R49.2 ; also sheet 5
EZ_D+: R43.1 U11.5(IO2) USB2.D+
EZ_D-: R46.1 U11.3(IO1) USB2.D-
EZ_VBUS [Power]: C43.2 U9.5(IN1) U9.6(IN2) U11.1(VCC) USB2.VBUS ; also sheet 5
EZ_VCC [Power]: C42.1 C47.2 C48.2 C49.1 R37.2 R39.2 R40.2 R44.2 R45.2 R47.2 R53.1 R54.1 U9.7(OUT2) U9.8(OUT1) U10.3(VCC) U10.23(TEST0) U10.24(TEST1) U10.25(VCC1) U12.8(VCC) ; also sheet 3,5
GND [Ground]: C42.2 C43.1 C44.2 C45.1 C46.1 C47.1 C48.1 C49.2 R38.1 R48.1 R50.1 R51.2 U9.3(GND) U9.4(EN) U10.8(GND) U10.15(DCD) U10.16(RI/CP) U10.18(GND1) U10.28(GND2) U11.4(GND) U12.1(E0) U12.2(E1) U12.3(E2) U12.4(VSS) U12.7(WC) USB2.GND ; also sheet 1,2,3,4,5,7
N$3: R49.1 R51.1 U10.27(X1)
N$4: R37.1 R38.2 U9.1(FB)
N$5: D2.A R41.1 U10.1(VREGEN)
N$6: D2.C U10.2(SUSPEND)
N$9: R39.1 U10.12(WAKEUP)
N$16: R52.2 U10.11(SCL)
N$17: R47.1 R50.2 U10.4(VDD18)
N$22: R48.2 USB2.GND@1(GND) USB2.GND@2(GND)
N$26: R42.2 U10.5(PUR)
N$30: C46.2 R46.2 U10.7(DM)
N$31: C45.2 R42.1 R43.2 U10.6(DP)
RESET: U9.2(RES) ; also sheet 5
RST3410: C44.1 R40.1 R41.2 U10.9(RESET) ; also sheet 5
SCL: R52.1 R54.2 U12.6(SCL) ; also sheet 5
SDA: R53.2 U10.10(SDA) U12.5(SDA) ; also sheet 5
UCTS: U10.13(CTS) ; also sheet 5
UDSR: U10.14(DSR) ; also sheet 5
UDTR: U10.21(DTR) ; also sheet 5
URTS: U10.20(RTS) ; also sheet 5
URXD: U10.19(SOUT) ; also sheet 5
UTXD: U10.17(SIN) ; also sheet 5
Unconnected: U10.22(CLKOUT) U10.26(X2) U10.29(P3.4) U10.30(P3.3) U11.2(NC)

### Notes on the sheet
- eZ430-FET LDO
- (3.6V  250mA)
- DNP
- 54819-0519
- DNP
- eZ430 FET : TUSB3410, TPS77301 LDO
- 2.2

## Sheet 7 of 8
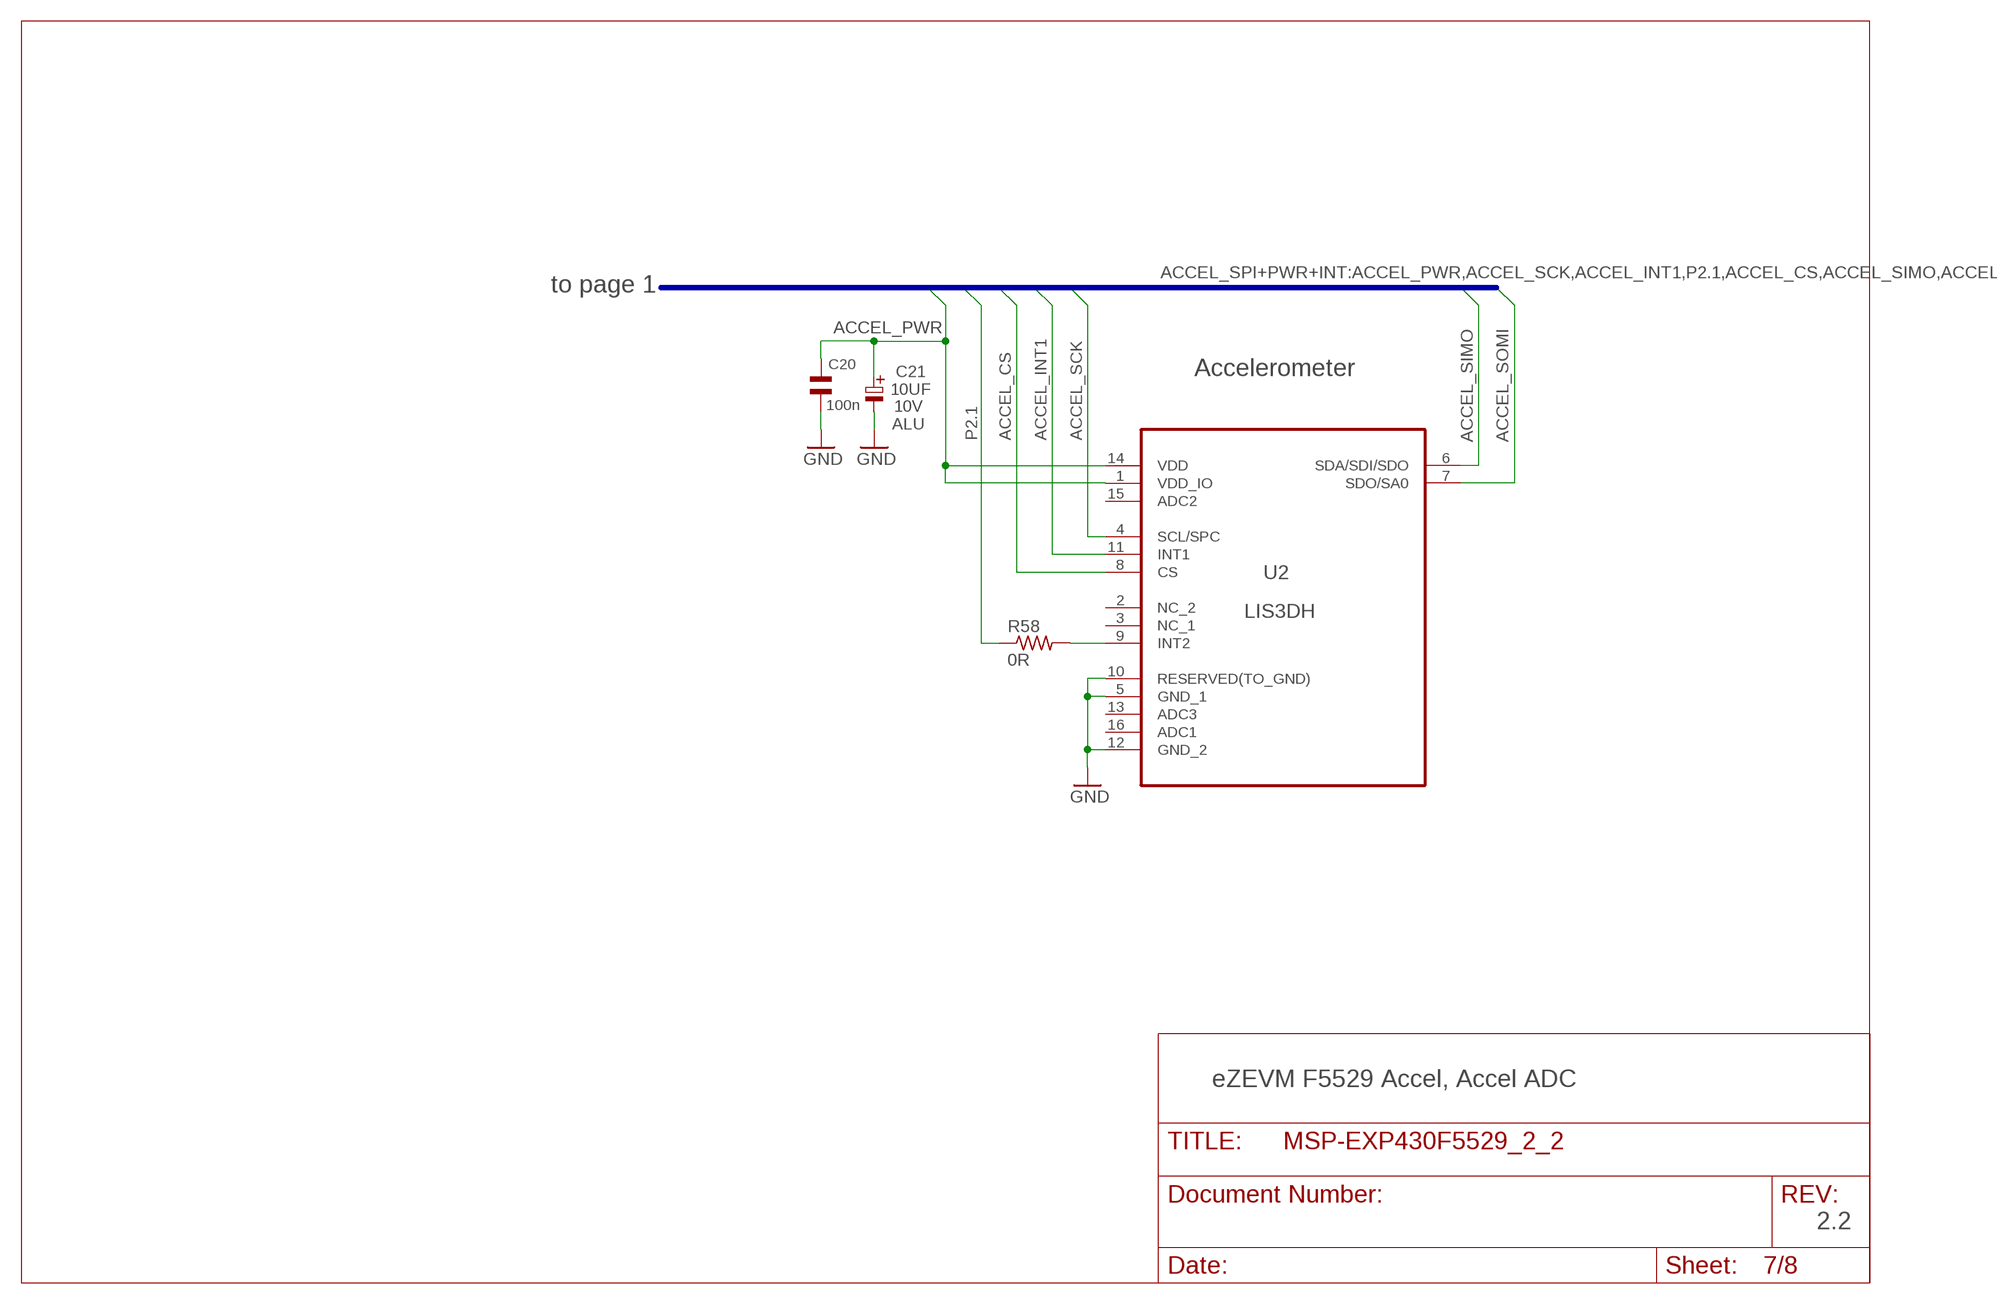
[diagram p6: schematic, sheet 7]

### Parts
C20  100n  C_SMD0402  [0402]
C21  10UF  FK4,7UF/35V-B  [ELKO_B]
R58  0R  R-US_R0603  [R0603]
U2  LIS3DH  [LGA16R50P3X5_300X300X100]

### Nets
ACCEL_CS: U2.8(CS) ; also sheet 1
ACCEL_INT1: U2.11(INT1) ; also sheet 1
ACCEL_PWR: C20.2 C21.+ U2.1(VDD_IO) U2.14(VDD) ; also sheet 1
ACCEL_SCK: U2.4(SCL/SPC) ; also sheet 1
ACCEL_SIMO: U2.6(SDA/SDI/SDO) ; also sheet 1
ACCEL_SOMI: U2.7(SDO/SA0) ; also sheet 1
GND [Ground]: C20.1 C21.- U2.5(GND_1) U2.10(RESERVED(TO_GND)) U2.12(GND_2) ; also sheet 1,2,3,4,5,6
N$18 [Power]: R58.2 U2.9(INT2)
P2.1: R58.1 ; also sheet 1,4
Unconnected: U2.2(NC_2) U2.3(NC_1) U2.13(ADC3) U2.15(ADC2) U2.16(ADC1)

### Buses
ACCEL_SPI+PWR+INT:ACCEL_PWR,ACCEL_SCK,ACCEL_INT1,P2.1,ACCEL_CS,ACCEL_SIMO,ACCEL_SOMI

### Notes on the sheet
- to page 1
- Accelerometer
- eZEVM F5529 Accel, Accel ADC
- 2.2

## Sheet 8 of 8
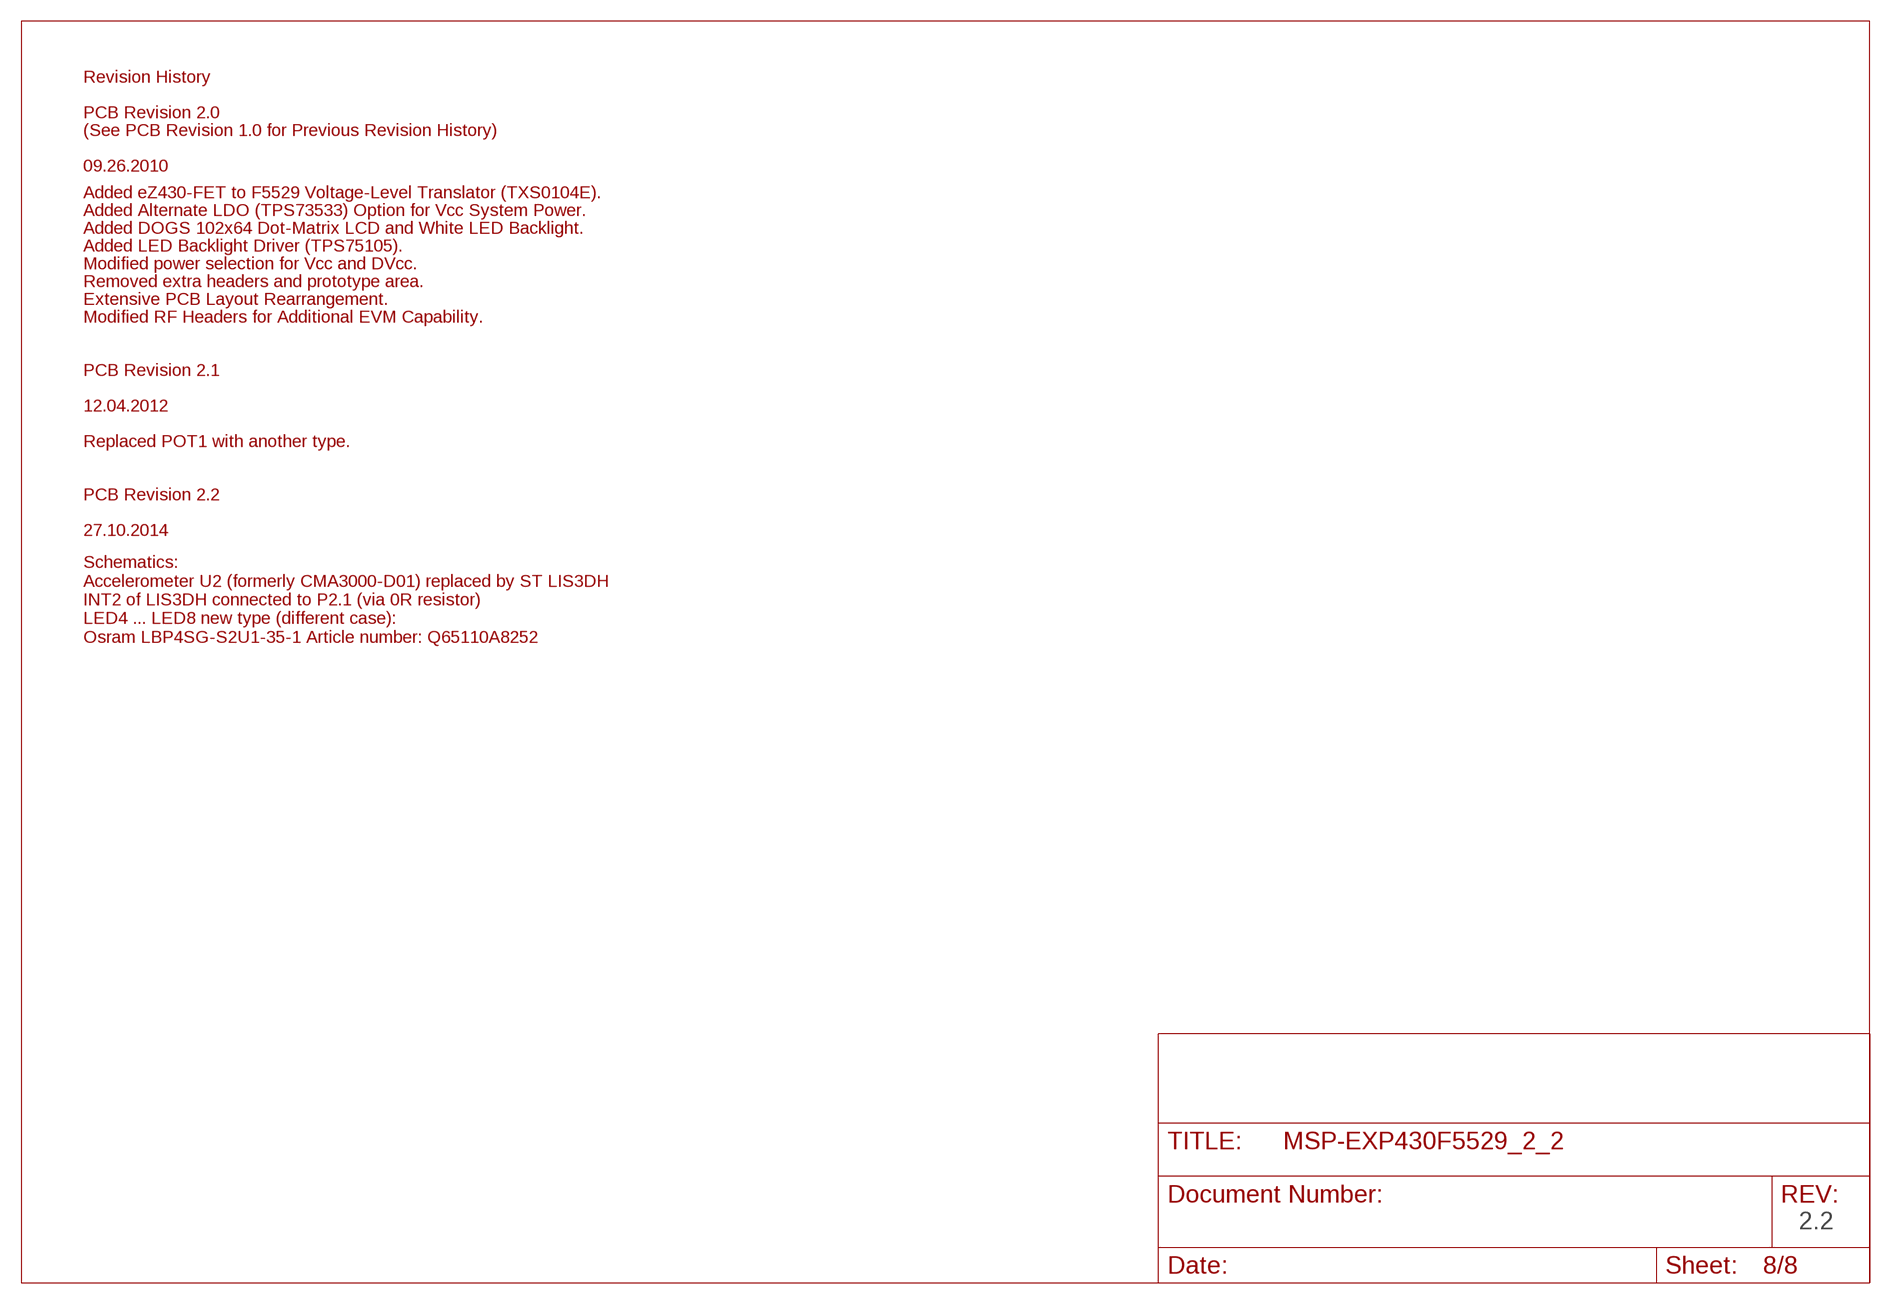
[diagram p7: schematic, sheet 8]

### Notes on the sheet
- Revision History
- PCB Revision 2.0
- (See PCB Revision 1.0 for Previous Revision History)
- 09.26.2010
- Added eZ430-FET to F5529 Voltage-Level Translator (TXS0104E).
- Added Alternate LDO (TPS73533) Option for Vcc System Power.
- Added DOGS 102x64 Dot-Matrix LCD and White LED Backlight.
- Added LED Backlight Driver (TPS75105).
- Modified power selection for Vcc and DVcc.
- Removed extra headers and prototype area.
- Extensive PCB Layout Rearrangement.
- Modified RF Headers for Additional EVM Capability.
- PCB Revision 2.1
- 12.04.2012
- Replaced POT1 with another type.
- PCB Revision 2.2
- 27.10.2014
- Schematics:
  Accelerometer U2 (formerly CMA3000-D01) replaced by ST LIS3DH
  INT2 of LIS3DH connected to P2.1 (via 0R resistor)
  LED4 ... LED8 new type (different case):
  Osram LBP4SG-S2U1-35-1 Article number: Q65110A8252
- 2.2

## Power pins joined to a net without a drawn wire
GND: U4.2(GND) U4.6(GND) U4.7(GND) U4.PP@1(GND) U4.PP@2(GND) U4.PP@3(GND) U4.PP@4(GND) U4.PP@5(GND) U4.TH(GND) U4.TH@1(GND) U4.TH@2(GND) U5.P$1(GND) U5.P$2(GND) U5.P$3(GND) U5.P$4(GND) U5.P$5(GND) U5.PP(GND)

## Library data of the parts
C1 C2 C4-C7 C18 C19 C22-C30 C32 = CAP:CSMD0805
C3 C8 C9 C11-C14 C16 C17 C33-C36 = rcl:C-EU: CAPACITOR, European symbol
C10 C15 C50 = smd:ELKO_1210
C20 C37-C49 = smd:C_SMD
C21 = Panasonic:FK*: Low ESR SMD ELKO's 105°C; C_CATEGORY: ALU; MANUFACTURER: Panasonic; MPN: EEE1AA100NR; SUPPLIER_1: Farnell; SUPPLIER_1#: 2326096; V_NEED: 3V3; V_RATING: 10V
C31 = rcl:C-US: CAPACITOR, American symbol
CON1-CON3 = _MSP430:8PIN_SM_MA_HEADER
D1 = diode:SCHOTTKY-MINI-MELF
D2 = diode:DIODE-: DIODE
J1 = CON-ML:ML14: HARTING
J4 J5 = pinhead:PINHD-2X7: PIN HEADER
J9 = Project7264:MOLEX3PIN: Molex 3Pin connector, RM 2,5mm, H=5,9mm, Digi Key Nr.: WM18887-ND; MOLEX-NR: 22-03-5035
J10 JP8 JP11 = pinhead:PINHD-1X3: PIN HEADER
J12 = MSP-EXP430F5529_2_0:_MSP430_RF_MA09-2: PIN HEADER
J13 = Project7264:SL127P6
J17 = susbfet:SL127L6TH
JP2 JP3 JP6 JP7 JP14 JP15 = jumper:JP1E: JUMPER
JP16 = sTI Lib:JP5Q: JUMPER
LED1-LED3 = led:LED: LED OSRAM: - CHIPLED LG R971, LG N971, LY N971, LG Q971, LY Q971, LO R971, LY R971 LH N974, LH R974 LS Q976, LO Q976, LY Q976 LO Q996 - Hyper CHIPLED LW Q18S LB Q993, LB Q99A, LB R99A - SideLED LS A670, LO A670, LY A670, LG A670, LP A670 LB A673, LV A673, LT A673, LW A673 LH A674 LY A675 LS A676, LA A676, LO A676, LY A676, LW A676 LS A679, LY A679, LG A679 - Hyper Micro SIDELED® LS Y876, LA Y876, LO Y876, LY Y876 LT Y87S - SmartLED LW L88C, LW L88S LB L89C, LB L89S, LG L890 LS L89K, LO L89K, LY L89K LS L896, LA L896, LO L896, LY L896 - TOPLED LS T670, LO T670, LY T670, LG T670, LP T670 LSG T670, LSP T670, LSY T670, LOP T670, LYG T670 LG T671, LOG T671, LSG T671 LB T673, LV T673, LT T673, LW T673 LH T674 LS T676, LA T676, LO T676, LY T676, LB T676, LH T676, LSB T676, LW T676 LB T67C, LV T67C, LT T67C, LS T67K, LO T67K, LY T67K, LW E67C LS E67B, LA E67B, LO E67B, LY E67B, LB E67C, LV E67C, LT E67C LW T67C LS T679, LY T679, LG T679 LS T770, LO T770, LY T770, LG T770, LP T770 LB T773, LV T773, LT T773, LW T773 LH T774 LS E675, LA E675, LY E675, LS T675 LS T776, LA T776, LO T776, LY T776, LB T776 LHGB T686 LT T68C, LB T68C - Hyper Mini TOPLED® LB M676 - Mini TOPLED Santana® LG M470 LS M47K, LO M47K, LY M47K Source: http://www.osram.convergy.de LUXEON: - LUMILED® LXK2-PW12-R00, LXK2-PW12-S00, LXK2-PW14-U00, LXK2-PW14-V00 LXK2-PM12-R00, LXK2-PM12-S00, LXK2-PM14-U00 LXK2-PE12-Q00, LXK2-PE12-R00, LXK2-PE12-S00, LXK2-PE14-T00, LXK2-PE14-U00 LXK2-PB12-K00, LXK2-PB12-L00, LXK2-PB12-M00, LXK2-PB14-N00, LXK2-PB14-P00, LXK2-PB14-Q00 LXK2-PR12-L00, LXK2-PR12-M00, LXK2-PR14-Q00, LXK2-PR14-R00 LXK2-PD12-Q00, LXK2-PD12-R00, LXK2-PD12-S00 LXK2-PH12-R00, LXK2-PH12-S00 LXK2-PL12-P00, LXK2-PL12-Q00, LXK2-PL12-R00 Source: www.luxeon.com KINGBRIGHT: KA-3528ASYC Source: www.kingbright.com
LED4-LED8 = Osram:LB_P4SG_Q65110A8252: Point LED Typ: LB P4SG Artikelnr.: Q65110A8252 Reverse mount Hersteller: Osram Technologie: SMD Bauform: Spezial erzeugt von: C. Zellner am: 25.9.2014 letzte Änderung: - Eagle-Version: 6.5.0; MANUFACTURER: Osram; MPN: LBP4SG-bbbb-35-1 (Q65110A8252)
LED9 = smd:LED_0603
PAD1-PAD5 = touchpad:TPAD_TOP: Touch Pad, 10x10mm
POT1 = Alpha:RV100F-30-4K1-B54
Q1 = MSP-EXP430F5438:F20XX_PIR_DEMO_&_EVAL_CM200T
Q2 = Project7264:QUARZ_HC49_4P: Quarz HC49/4H Sonderform mit 4 Pins, Höhe 4mm
Q3 = susbfet:XTL_FT7A
R1 R2 R6 R12-R27 R58 = rcl:R-US_: RESISTOR, American symbol
R3-R5 = _MSP430:R-US_: RESISTOR, American symbol
R7-R11 = _MSP430:RES
R28-R54 = smd:R_SMD
RF1 RF2 = _MSP430_RF:TFM-110-02-SM-D-A-K
S1-S4 = electricalmeter:PB: OMRON SWITCH
SW1 = _5438_ATC:3PDT
TP1-TP8 = _5438_ATC:TP
TP9-TP15 = usbfet:TP05
U1 = TI_MSP430_v16_intern:F552X---PN80: ***MSP430F552X***PN80 http://www.ti.com/lit/gpn/msp430f5529 Rev1.0 06/2010 For F552X where X is 1,5,7,9
U2 = ST:LIS3DH: MEMS motion sensor Typ: LIS3DH Hersteller: ST Microlectronics Technologie: SMD Bauform: LGA-16 erzeugt von: C. Zellner am: 18.9.2014 letzte Änderung: - Eagle-Version: 6.5.0; MANUFACTURER: ST Microelectronics; MPN: LIS3DH; PACKAGE: LGA-16; SUPPLIER_1: Farnell; SUPPLIER_1#: 1872923
U3 = ea:EADOGS102-6: HIGH-CONTRAST102x64 PIXEL LCD SUPERTWIST DISPLAY WITH LED BACKLIGHT UC1701 CONTROLLER WITH SPI (4-WIRE) INTERFACE
U4 = texas:TPS735*: 500mA, Low Quiescent Current, Ultra-Low Noise, High PSRR Low Dropout Linear Regulator
U5 = texas:TPS7510X: Low Dropout, Two-Bank LED Driver with PWM Brightness Control
U6 U11 = Project7264:TPD2E001: TPD2E001 ESD-protection diode array
U7 = TI_MSP430_v11:F16X---PM64: *** MSP430F16x *** PM64
U8 = texas:TXS0104E: 4-BIT BIDIRECTIONAL VOLTAGE-LEVEL TRANSLATOR FOR OPEN-DRAIN AND PUSH-PULL APPLICATIONS
U9 = gangprog:TPS773XX: VReg, 250mA
U10 = usbfet:TUSB3410: TI: TUSB3410: USB2UART-Controller
U12 = MSP-EXP430F5529_2_0:USBFET_M24XXX: Serial EEProm: 24LC xxx
USB1 USB2 = _con-usb-2:USB: USB Connectors
X1 = Project7264:SD-502702-003: SD-Micro Card connector, Hersteller Molex, H=1,53mm

## Net classes
0 Default: width 0.254 mm, drill 0.305 mm, clearance 0.152 mm
1 Ground: width 0.305 mm, drill 0.305 mm, clearance 0.152 mm to class 0, clearance 0.152 mm
2 Power: width 0.406 mm, drill 0.305 mm, clearance 0.152 mm to class 0, clearance 0.152 mm to class 1, clearance 0.152 mm